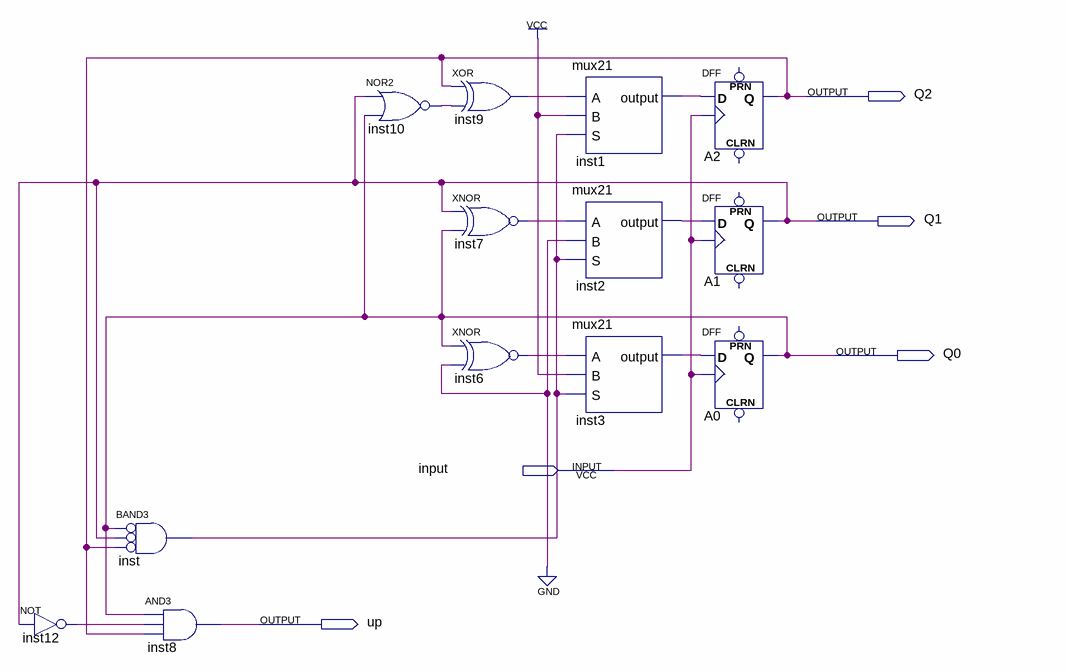
[diagram p0: schematic sheet]
// Quartus schematic mod6.bdf as structural Verilog: 13 symbols, 5 pins
module mod6 (
  input  \input ,
  output Q2,
  output Q1,
  output Q0,
  output up
);

  wire inst1_output, inst2_output, inst3_output, inst6_out, inst7_out, inst9_out, inst10_out, inst12_out,
       inst_out;

  not inst12 (inst12_out, Q1);
  and inst (inst_out, ~Q0, ~Q1, ~Q2);  // BAND3
  and inst8 (up, Q0, inst12_out, Q2);
  nor inst10 (inst10_out, Q1, Q0);
  xor inst9 (inst9_out, Q2, inst10_out);
  xnor inst7 (inst7_out, Q1, Q0);
  xnor inst6 (inst6_out, Q0, 1'b0);
  mux21 inst1 (.A(inst9_out), .B(1'b1), .S(inst_out), .\output (inst1_output));
  mux21 inst2 (.A(inst7_out), .B(1'b0), .S(inst_out), .\output (inst2_output));
  mux21 inst3 (.A(inst6_out), .B(1'b1), .S(inst_out), .\output (inst3_output));
  DFF A2 (.CLK(\input ), .D(inst1_output), .Q(Q2));  // open: CLRN, PRN
  DFF A1 (.CLK(\input ), .D(inst2_output), .Q(Q1));  // open: CLRN, PRN
  DFF A0 (.CLK(\input ), .D(inst3_output), .Q(Q0));  // open: CLRN, PRN
endmodule
